# EAGLE design Raspi Version 2 (EAGLE 9.1.2)
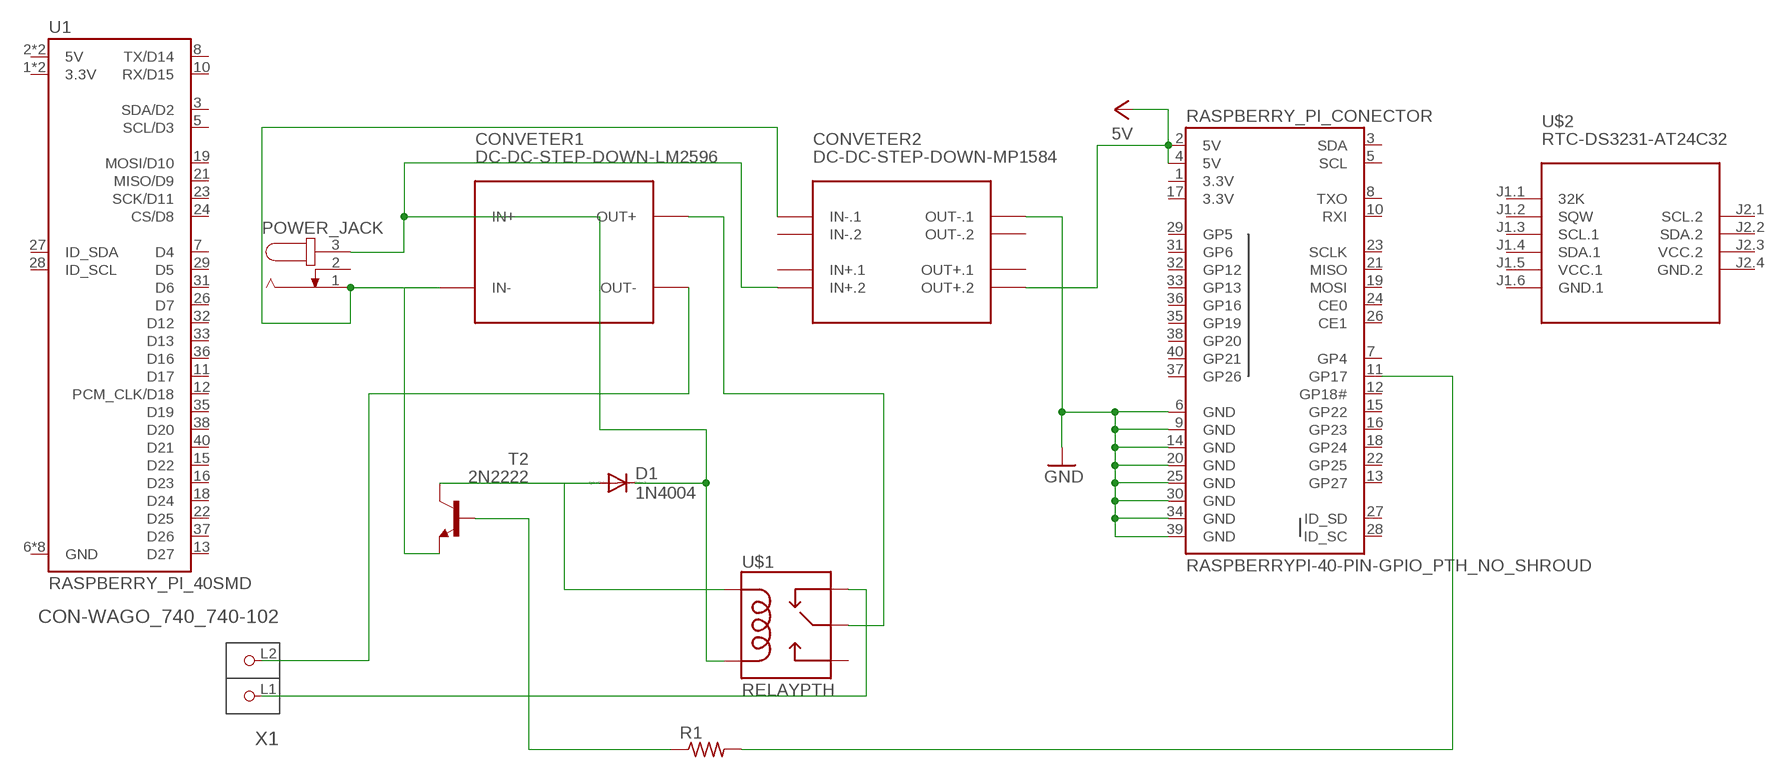
[diagram p0: schematic, sheet 1]

## Parts
CONVETER1  DC-DC-STEP-DOWN-LM2596  [DC-DC-STEP-DOWN-LM2596]
CONVETER2  DC-DC-STEP-DOWN-MP1584  [DC-DC-STEP-DOWN-MP1584]
D1  1N4004  [DO41-10]
POWER_JACK  JACK-PLUG0  [SPC4077]
R1  R-US_0207/10  [0207/10]
RASPBERRY_PI_CONECTOR  RASPBERRYPI-40-PIN-GPIO_PTH_NO_SHROUD  [2X20]
T2  2N2222  [TO92-EBC-OVAL]
U1  RASPBERRY_PI_40SMD  [RASPBERRY_PI_SHIELD_HOLES]
U$1  RELAYPTH  [SRD-05VDC-SL-C]
U$2  RTC-DS3231-AT24C32  [RTC-DS3231-AT24C32]
X1  CON-WAGO_740_740-102  [CON-WAGO_740_P-740-102]

## Nets
GND: CONVETER2.OUT-.1 RASPBERRY_PI_CONECTOR.6(GND) RASPBERRY_PI_CONECTOR.9(GND) RASPBERRY_PI_CONECTOR.14(GND) RASPBERRY_PI_CONECTOR.20(GND) RASPBERRY_PI_CONECTOR.25(GND) RASPBERRY_PI_CONECTOR.30(GND) RASPBERRY_PI_CONECTOR.34(GND) RASPBERRY_PI_CONECTOR.39(GND)
N$1: CONVETER1.IN+ CONVETER2.IN+.2 D1.C POWER_JACK.3 U$1.COIL0
N$4: CONVETER1.OUT- X1.L2(P2)
N$5: CONVETER1.IN- CONVETER2.IN-.1 POWER_JACK.1 T2.E
N$7: R1.2 RASPBERRY_PI_CONECTOR.11(GP17)
N$8: D1.A T2.C U$1.COIL1
N$11: R1.1 T2.B
N$12: U$1.SWCLOSED(SWCLOSE) X1.L1(P1)
N$13: CONVETER1.OUT+ U$1.SWCOMMON
VCC: CONVETER2.OUT+.2 RASPBERRY_PI_CONECTOR.2(5V) RASPBERRY_PI_CONECTOR.4(5V) ; supply symbol labelled 5V
Unconnected: CONVETER2.IN+.1 CONVETER2.IN-.2 CONVETER2.OUT+.1 CONVETER2.OUT-.2 POWER_JACK.2 RASPBERRY_PI_CONECTOR.3(SDA) RASPBERRY_PI_CONECTOR.5(SCL) RASPBERRY_PI_CONECTOR.7(GP4) RASPBERRY_PI_CONECTOR.8(TXO) RASPBERRY_PI_CONECTOR.10(RXI) RASPBERRY_PI_CONECTOR.12(GP18#) RASPBERRY_PI_CONECTOR.13(GP27) RASPBERRY_PI_CONECTOR.15(GP22) RASPBERRY_PI_CONECTOR.16(GP23) RASPBERRY_PI_CONECTOR.18(GP24) RASPBERRY_PI_CONECTOR.19(MOSI) RASPBERRY_PI_CONECTOR.21(MISO) RASPBERRY_PI_CONECTOR.22(GP25) RASPBERRY_PI_CONECTOR.23(SCLK) RASPBERRY_PI_CONECTOR.24(CE0) RASPBERRY_PI_CONECTOR.26(CE1) RASPBERRY_PI_CONECTOR.27(ID_SD) RASPBERRY_PI_CONECTOR.28(ID_SC) RASPBERRY_PI_CONECTOR.29(GP5) RASPBERRY_PI_CONECTOR.31(GP6) RASPBERRY_PI_CONECTOR.32(GP12) RASPBERRY_PI_CONECTOR.33(GP13) RASPBERRY_PI_CONECTOR.35(GP19) RASPBERRY_PI_CONECTOR.36(GP16) RASPBERRY_PI_CONECTOR.37(GP26) RASPBERRY_PI_CONECTOR.38(GP20) RASPBERRY_PI_CONECTOR.40(GP21) U1.1(3.3V) U1.2(5V) U1.3(SDA/D2) U1.4(5V) U1.5(SCL/D3) U1.6(GND) U1.7(D4) U1.8(TX/D14) U1.9(GND) U1.10(RX/D15) U1.11(D17) U1.12(PCM_CLK/D18) U1.13(D27) U1.14(GND) U1.15(D22) U1.16(D23) U1.17(3.3V) U1.18(D24) U1.19(MOSI/D10) U1.20(GND) U1.21(MISO/D9) U1.22(D25) U1.23(SCK/D11) U1.24(CS/D8) U1.25(GND) U1.26(D7) U1.27(ID_SDA) U1.28(ID_SCL) U1.29(D5) U1.30(GND) U1.31(D6) U1.32(D12) U1.33(D13) U1.34(GND) U1.35(D19) U1.36(D16) U1.37(D26) U1.38(D20) U1.39(GND) U1.40(D21) U$1.SWOPEN U$2.J1.1(32K) U$2.J1.2(SQW) U$2.J1.3(SCL.1) U$2.J1.4(SDA.1) U$2.J2.1(SCL.2) U$2.J2.2(SDA.2)

## Power pins joined to a net without a drawn wire
3.3V: RASPBERRY_PI_CONECTOR.1(3.3V) RASPBERRY_PI_CONECTOR.17(3.3V)
GND.1: U$2.J1.6(GND.1)
GND.2: U$2.J2.4(GND.2)
VCC.1: U$2.J1.5(VCC.1)
VCC.2: U$2.J2.3(VCC.2)

## Library data of the parts
CONVETER1 = GHIdiy-modules:DC-DC-STEP-DOWN-LM2596: DC/DC Step-Down Regulator based on LM2596-ADJ chip LM2596 datasheet available here: http://www.ti.com/lit/ds/symlink/lm2596.pdf Click here to find device on ebay.com <http://www.ebay.com/sch/lm2596+power+regulator>
CONVETER2 = GHIdiy-modules:DC-DC-STEP-DOWN-MP1584: DC/DC Step-Down Regulator based on MP1584 chip MP1584 datasheet available here: http://www.haoyuelectronics.com/Attachment/MP1584/MP1584.pdf Click here to find device on ebay.com <http://www.ebay.com/sch/mp1584+module>
D1 = diode:1N4004: DIODE general purpose rectifier, 1 A
POWER_JACK = con-jack:JACK-PLUG: DC POWER JACK Power Jack, DC, Right Angle, Through Hole, Rated 5A at 16VDC, PC Terminals Distributor: Farnell (www.Farnell.de) Drawing: 84N1161.pdf / 84N1162.pdf Manufacturer: SPC Technology (www.spctechnology.com) Type: SPC4077 / SPC 4078; OC_FARNELL: unknown; OC_NEWARK: unknown
R1 = adafruit:R-US_: RESISTOR, American symbol
RASPBERRY_PI_CONECTOR = SparkFun-Connectors:RASPBERRYPI-40-PIN-GPIO: Raspberry Pi GPIO Header 2x20 pin connector, as found on B, B+, A+ models. Both shrouded PTH and SMT versions available. SparkFun Products: GPIO Shrouded Header <https://www.sparkfun.com/products/13054>- PTH SparkFun Pi Wedge (Preassembled) <https://www.sparkfun.com/products/13717>
T2 = adafruit:2N2222: NPN TRANSISTOR Big oval pads
U1 = SparkFun-Connectors:RASPBERRY_PI_40
U$1 = SRD-Relay:RELAY: SPDT relay (COM-00101)
U$2 = GHIdiy-modules:RTC-DS3231-AT24C32: RTC Module with Battery and EEPROM based on DS3231 and AT24C32 chips Tutorial can be found here: https://edwardmallon.wordpress.com/2014/05/21/using-a-cheap-3-ds3231-rtc-at24c32-eeprom-from-ebay/ Click here to find device on ebay.com <http://www.ebay.com/sch/DS3231+AT24C32+module>
X1 = Termnal block:CON-WAGO_740_740-102: Serie 740, Klemmenleiste für Leiterplatten 1 Lötstift/Pol / Series 740, PCB terminal strip 1 solder pin/pole Polzahl / Pole No.: 2 Rastermaß / Pitch: 5 mm Bemessungsspannung / Rated Voltage: 320 V Nennstrom / Nominal Current: 16 A Leiterquerschnitt / Conductor Size: 0.08 - 2.5 mm² Anschlusstechnik / Connection Technology: CAGE CLAMP® Lötstiftlänge: / Solder Pin Length: 5.1 mm Leitereinführung (zur Platine) / Conductor entry angle (to PCB): 0 ° Farbe / Color: grau / gray Stand: 01.01.2012. Die jeweils aktuellen Daten zu diesem Artikel finden Sie in unserem Produktkatalog, den Sie unter www.wago.com einsehen können. As of: 01/01/2012. Please find the newest data for this article in our product catalogue, which can be viewed under www.wago.com.

## Net classes
0 default: width 0.762 mm, drill 0.762 mm, clearance 0.635 mm
1 power: width 0.762 mm, drill 0.762 mm, clearance 0.635 mm
2 data: width 0.762 mm, drill 0.762 mm, clearance 0.635 mm

## Board
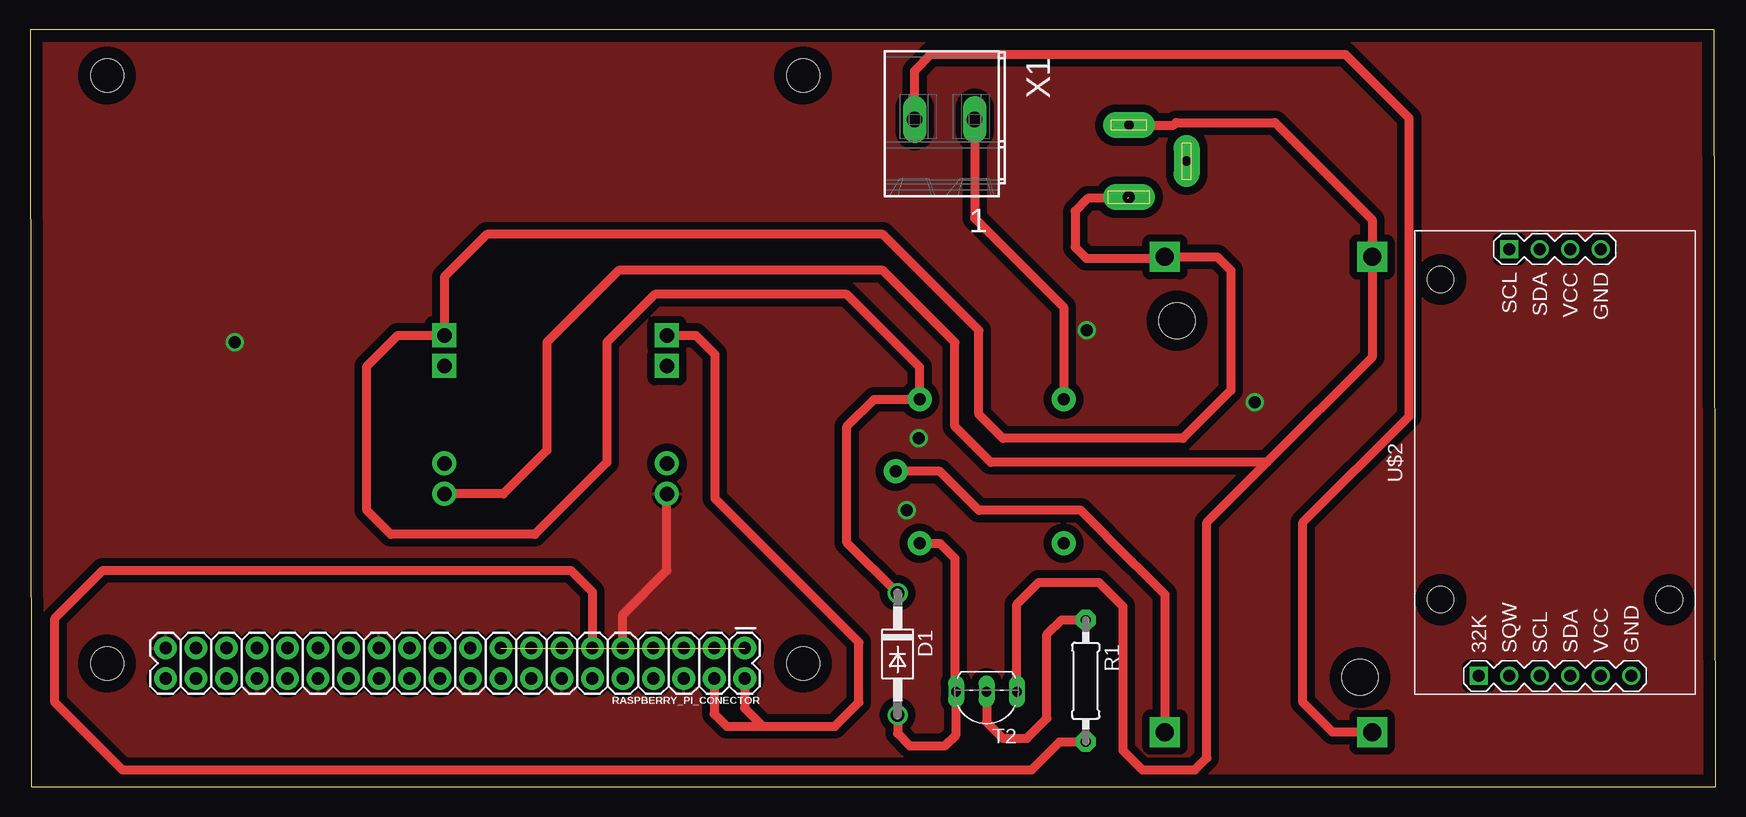
[diagram p1: board, top side]
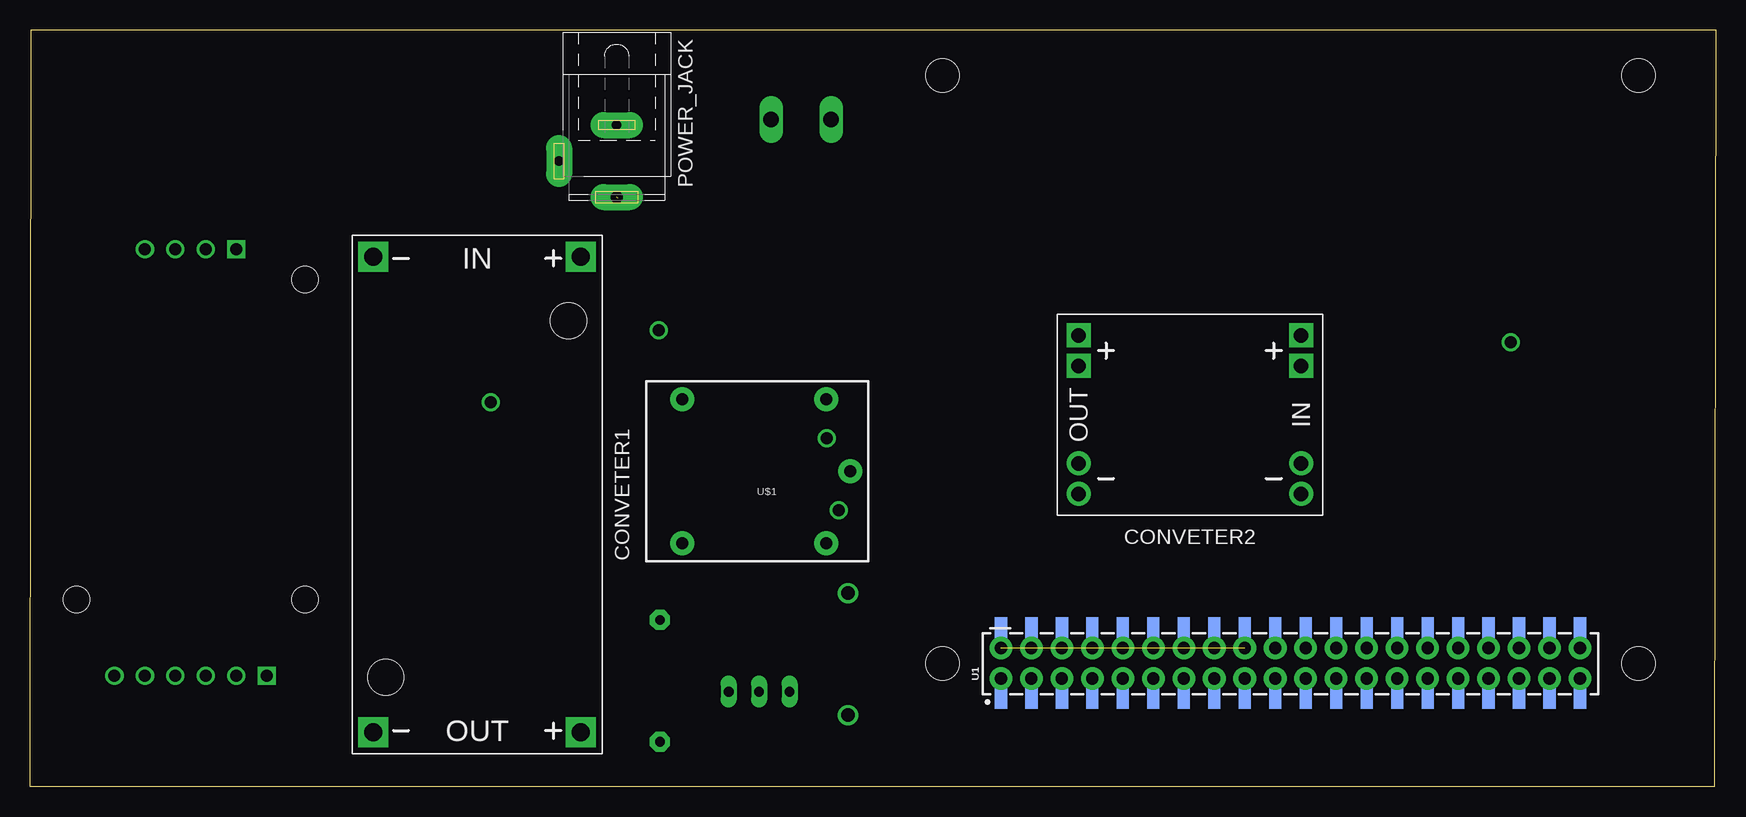
[diagram p2: board, bottom side, seen from below]

Size 140.47 x 63.05 mm. Coordinates in mm from the lower left corner, seen from the top.
Outline: 0.12,0 140.47,0 140.35,63.05 0,63.05 0.12,0
Copper layers (1*16): Top 0.035mm / dielectric 1.5mm / Bottom 0.035mm
Design rules "default": minimum track width 6mil, minimum drill 0.35mm, track to track 6mil, track to pad 6mil, pad to pad 6mil, via to via 6mil, smd to smd 6mil, copper to edge 40mil, drill to drill 6mil, minimum pad ring 10mil, minimum via ring 8mil, stop-mask expansion 4mil, vias tented up to drill 0mil, thermal gap 10mil

### Footprints (pad centres in the part's own frame; a part is rotated, then mirrored left to right if it is on the bottom)
DC-DC-STEP-DOWN-LM2596 = drill 1.5 pad 2.5 square: IN+ -19.812,8.636; IN- -19.812,-8.636; OUT+ 19.812,8.636; OUT- 19.812,-8.636 | hole 3: -14.478,7.62; 15.24,-7.62
DC-DC-STEP-DOWN-MP1584 = drill 1.2 pad 2 square: IN+.1 -9.271,-4.064; IN+.2 -9.271,-6.604; OUT+.1 9.271,-4.064; OUT+.2 9.271,-6.604 | drill 1.2 pad 2: IN-.1 -9.271,6.604; IN-.2 -9.271,4.064; OUT-.1 9.271,6.604; OUT-.2 9.271,4.064
DO41-10 = drill 1.118: A 5.08,0; C -5.08,0
SPC4077 = drill 0.8 pad 2.184 long: 1 -3,0; 2 0,-4.8 | drill 1 pad 2.184 long: 3 3,0
0207/10 = drill 0.813 pad 1.676 octagon: 1 -5.08,0; 2 5.08,0
2X20 = drill 1.016 pad 1.88: 1 0,0; 2 0,2.54; 3 2.54,0; 4 2.54,2.54; 5 5.08,0; 6 5.08,2.54; 7 7.62,0; 8 7.62,2.54; 9 10.16,0; 10 10.16,2.54; 11 12.7,0; 12 12.7,2.54; 13 15.24,0; 14 15.24,2.54; 15 17.78,0; 16 17.78,2.54; 17 20.32,0; 18 20.32,2.54; 19 22.86,0; 20 22.86,2.54; 21 25.4,0; 22 25.4,2.54; 23 27.94,0; 24 27.94,2.54; 25 30.48,0; 26 30.48,2.54; 27 33.02,0; 28 33.02,2.54; 29 35.56,0; 30 35.56,2.54; 31 38.1,0; 32 38.1,2.54; 33 40.64,0; 34 40.64,2.54; 35 43.18,0; 36 43.18,2.54; 37 45.72,0; 38 45.72,2.54; 39 48.26,0; 40 48.26,2.54
TO92-EBC-OVAL = drill 0.813 long: B 0,-1.27; C 2.54,-1.27; E -2.54,-1.27
RASPBERRY_PI_SHIELD_HOLES = smd 1.02 x 1.87: 1 8.382,7.686; 2 8.382,1.929; 3 10.922,7.686; 4 10.922,1.929; 5 13.462,7.686; 6 13.462,1.929; 7 16.002,7.686; 8 16.002,1.929; 9 18.542,7.686; 10 18.542,1.929; 11 21.082,7.686; 12 21.082,1.929; 13 23.622,7.686; 14 23.622,1.929; 15 26.162,7.686; 16 26.162,1.929; 17 28.702,7.686; 18 28.702,1.929; 19 31.242,7.686; 20 31.242,1.929; 21 33.782,7.686; 22 33.782,1.929; 23 36.322,7.686; 24 36.322,1.929; 25 38.862,7.686; 26 38.862,1.929; 27 41.402,7.686; 28 41.402,1.929; 29 43.942,7.686; 30 43.942,1.929; 31 46.482,7.686; 32 46.482,1.929; 33 49.022,7.686; 34 49.022,1.929; 35 51.562,7.686; 36 51.562,1.929; 37 54.102,7.686; 38 54.102,1.929; 39 56.642,7.686; 40 56.642,1.929 | hole 2.75: 3.512,4.775; 61.512,4.775; 61.512,53.775; 3.512,53.775
SRD-05VDC-SL-C = drill 1 pad 2: COIL0 -5.39,-6.12; COIL1 -5.39,5.88; SWCLOSED 6.61,-6.12; SWCOMMON -7.39,-0.12; SWOPEN 6.61,5.88
RTC-DS3231-AT24C32 = drill 1 square: J1.1 -17.78,6.35; J2.1 17.78,3.81 | drill 1: J1.2 -17.78,3.81; J1.3 -17.78,1.27; J1.4 -17.78,-1.27; J1.5 -17.78,-3.81; J1.6 -17.78,-6.35; J2.2 17.78,1.27; J2.3 17.78,-1.27; J2.4 17.78,-3.81 | hole 2.2: -11.43,-9.525; -11.43,9.525; 15.24,9.525
CON-WAGO_740_P-740-102 = drill 1.3 long: L1 -0.35,2.5; L2 -0.35,-2.5

### Placement (x,y rotation side)
CONVETER1  103.21,24.34 270 bottom
CONVETER2  43.81,30.99 180 bottom
D1  72.3,11.04 270 top
POWER_JACK  91.58,52.13 270 bottom
R1  87.98,8.81 270 top
RASPBERRY_PI_CONECTOR  59.56,11.54 180 top
T2  79.71,6.64 180 top
U1  67.94,5.47 0 bottom
U$1  79.52,26.15 180 bottom
U$2  127.08,27.01 90 top
X1  76.22,55.25 270 top

### Tracks (layer width: path | path; a pad name or v marks a point on that pad's centre or on a via)
3.3V  (1 unrouted)
GND  (via drill 1)
  Top 0.762: RASPBERRY_PI_CONECTOR.9 49.4,14.33 53.08,18.01 CONVETER2.OUT-.1
  other vias: 17.08,37.01 102.08,32.01 88.08,38.01 73.08,23.01 74.08,29.01
  pour Top: -4.92,71.01 -4.92,-4.99 147.08,-4.99 147.08,71.01
N$1  (1 unrouted)
  Top 0.762: 91.46,49.01 88.15,49.01 87.09,47.95 87.09,44.95 88.03,44.01 94.57,44.01 CONVETER1.IN+ 98.94,44.15 100.08,43.01 100.08,33.01 96.08,29.01 81.08,29.01 79.08,31.01 79.08,38.01 71.08,46.01 38.08,46.01 34.54,42.47 CONVETER2.IN+.2 30.66,37.59 28.08,35.01 28.08,23.01 30.08,21.01 42.08,21.01 48.08,27.01 48.08,37.01 52.08,41.01 68.08,41.01 74.13,34.96 U$1.COIL0 70.34,32.27 68.08,30.01 68.08,20.34 D1.C
N$4
  Top 0.762: X1.L2 73.72,59.65 75.08,61.01 109.62,61.01 114.35,56.28 | 114.35,56.28 114.67,55.96 | CONVETER1.OUT- 108.56,4.53 106.08,7.01 106.08,22.01 114.92,30.85 114.92,55.71 114.35,56.28
N$5
  Top 0.762: POWER_JACK.1 95.31,55.13 95.51,55.33 103.76,55.33 111.85,47.24 CONVETER1.IN- 111.85,35.78 103.08,27.01 | 103.08,27.01 80.08,27.01 77.08,30.01 77.08,37.01 71.08,43.01 49.08,43.01 43.08,37.01 43.08,28.01 39.46,24.39 CONVETER2.IN-.1 | T2.E 82.25,15.18 84.08,17.01 89.08,17.01 91.08,15.01 91.08,3.01 92.69,1.4 97.08,1.4 98.08,2.4 98.08,22.01 103.08,27.01
N$7
  Top 0.762: RASPBERRY_PI_CONECTOR.11 46.86,16.23 45.08,18.01 6.08,18.01 2.08,14.01 2.08,7.01 7.69,1.4 83.47,1.4 85.8,3.73 R1.2
N$8
  Top 0.762: D1.A 72.3,4.42 73.33,3.39 76.22,3.39 77.17,4.33 T2.C 77.08,8 77.08,19.01 75.82,20.27 U$1.COIL1
N$11
  Top 0.762: T2.B 79.71,5.38 81.08,4.01 83.08,4.01 84.74,5.67 84.74,12.67 85.96,13.89 R1.1
N$12
  Top 0.762: X1.L1 78.72,47.37 86.13,39.96 U$1.SWCLOSED
N$13
  Top 0.762: U$1.SWCOMMON 75.82,26.27 79.08,23.01 87.57,23.01 91.83,18.76 92.57,18.01 94.57,16.01 CONVETER1.OUT+
VCC
  Top 0.762: RASPBERRY_PI_CONECTOR.4 57.02,6.07 58.08,5.01 61.08,5.01 | 61.08,5.01 67.08,5.01 69.08,7.01 69.08,12.01 57.08,24.01 57.08,36.01 55.5,37.59 CONVETER2.OUT+.2 | RASPBERRY_PI_CONECTOR.2 59.56,6.53 61.08,5.01